# EAGLE design Pyr0-Piezo-FFC-Direct-Creality-X-Board.2.1.2 (EAGLE 9.5.1)
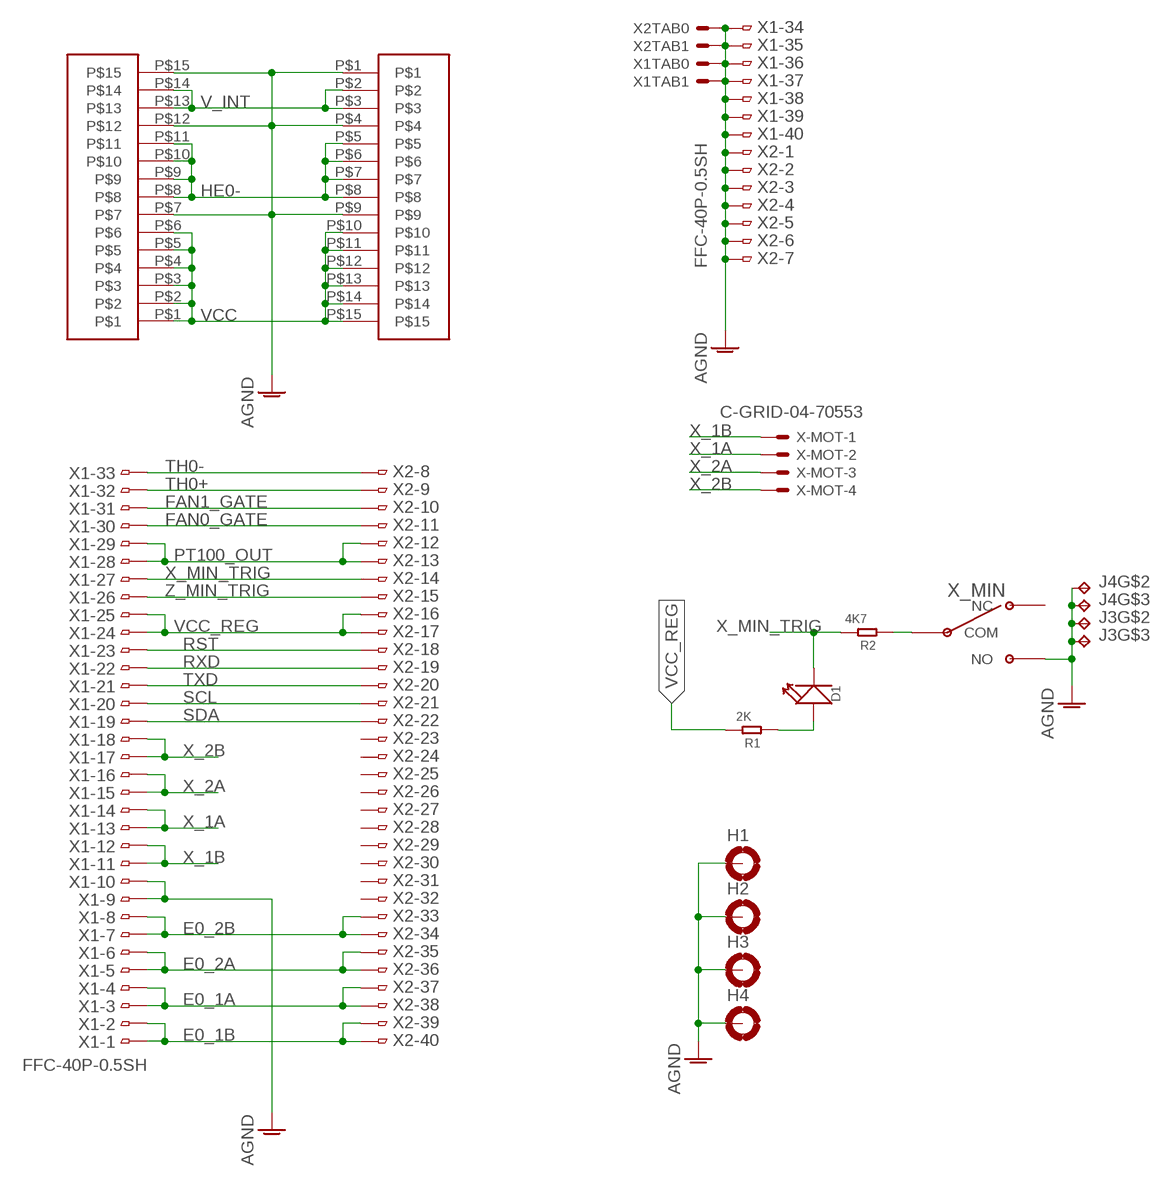
[diagram p0: schematic, sheet 1]

## Parts
D1  SEEED-LED_SMD-LED-CLEAR-BLUE(0603)LED_0603  [SEEED-LED_LED-0603]
H1  HOLES_MOUNT-PAD-ROUND3.2  [HOLES_3,2-PAD]
H2  HOLES_MOUNT-PAD-ROUND3.2  [HOLES_3,2-PAD]
H3  HOLES_MOUNT-PAD-ROUND3.2  [HOLES_3,2-PAD]
H4  HOLES_MOUNT-PAD-ROUND3.2  [HOLES_3,2-PAD]
J3  FFC-15P-1MM  [FFC-15P-1MM]
J4  FFC-15P-1MM  [FFC-15P-1MM]
R1  2K  SMD-RES-2K-5%-1/8W(0805)  [R0805]
R2  4K7  SMD-RES-2K-5%-1/8W(0805)  [R0805]
X1  FFC-40P-0.5SH  [FH12-40S-0.5SH]
X2  FFC-40P-0.5SH  [FH12-40S-0.5SH]
X-MOT  C-GRID-04-70553  [70553-04]
X_MIN  LIMIT_SWITCH  [LIMIT_SWITCH_BRIDGE]

## Nets
AGND [VCC]: H1.B3,2(MOUNT) H2.B3,2(MOUNT) H3.B3,2(MOUNT) H4.B3,2(MOUNT) J3.P$7 J3.P$12 J3.P$15 J3.P$16(TP) J3.P$17(TP) J4.P$1 J4.P$4 J4.P$9 J4.P$16(TP) J4.P$17(TP) X1.9 X1.10 X1.34 X1.35 X1.36 X1.37 X1.38 X1.39 X1.40 X1.TAB0 X1.TAB1 X2.1 X2.2 X2.3 X2.4 X2.5 X2.6 X2.7 X2.TAB0 X2.TAB1 X_MIN.NO
E0_1A [Motor]: X1.3 X1.4 X2.37 X2.38
E0_1B [Motor]: X1.1 X1.2 X2.39 X2.40
E0_2A [Motor]: X1.5 X1.6 X2.35 X2.36
E0_2B [Motor]: X1.7 X1.8 X2.33 X2.34
FAN0_GATE [Fan]: X1.30 X2.11
FAN1_GATE [Fan]: X1.31 X2.10
HE0- [VCC]: J3.P$8 J3.P$9 J3.P$10 J3.P$11 J4.P$5 J4.P$6 J4.P$7 J4.P$8
PT100_OUT [Fan]: X1.28 X1.29 X2.12 X2.13
RST: X1.23 X2.18
RXD: X1.22 X2.19
SCL: X1.20 X2.21
SDA: X1.19 X2.22
TH0+: X1.32 X2.9
TH0-: X1.33 X2.8
TXD: X1.21 X2.20
V_INT [Fan]: J3.P$13 J3.P$14 J4.P$2 J4.P$3
VCC [VCC]: J3.P$1 J3.P$2 J3.P$3 J3.P$4 J3.P$5 J3.P$6 J4.P$10 J4.P$11 J4.P$12 J4.P$13 J4.P$14 J4.P$15
VCC_REG [Fan]: R1.2 X1.24 X1.25 X2.16 X2.17
X_1A [Motor]: X1.13 X1.14 X-MOT.2
X_1B [Motor]: X1.11 X1.12 X-MOT.1
X_2A [Motor]: X1.15 X1.16 X-MOT.3
X_2B [Motor]: X1.17 X1.18 X-MOT.4
X_MIN_LED: D1.+ R1.1
X_MIN_TRIG: D1.- R2.2 X1.27 X2.14
X_PULLDOWN: R2.1 X_MIN.COM
Z_MIN_TRIG: X1.26 X2.15
Unconnected: X2.23 X2.24 X2.25 X2.26 X2.27 X2.28 X2.29 X2.30 X2.31 X2.32 X_MIN.NC

## Library data of the parts
D1 = PiezoFFC:SEEED-LED_SMD-LED-CLEAR-BLUE(0603): 304090045
H1-H4 = PiezoFFC:HOLES_MOUNT-PAD-ROUND: MOUNTING PAD, round
J3 J4 = PiezoFFC:FFC-15P-1MM
R1 = PiezoFFC:SMD-RES-2K-5%-1/8W(0805): 301010318; MPN: RC0805JR-072KL
R2 = PiezoFFC:SMD-RES-2K-5%-1/8W(0805): 301010318; MPN: RC0805JR-072KL; VALUE: 2K
X1 X2 = PiezoFFC:FFC-40P-0.5S: 0.5mm Pitch Connectors For FPC/FFC Source: Data sheet <http://www.hirose.co.jp/cataloge_hp/e58605370.pdf>; MPN: FH12-40S-0.5SH(55); OC_FARNELL: 1324556; OC_NEWARK: 34M6178
X-MOT = PiezoFFC:C-GRID-04: CONNECTOR wire to board 2.54 mm (0.100") pitch header; MF: MOLEX; OC_FARNELL: unknown; OC_NEWARK: unknown
X_MIN = PiezoFFC:LIMIT_SWITCH

## Net classes
1 Motor: width 0.61 mm, drill 0.45 mm, clearance 0.254 mm to class 0, clearance 0.254 mm
2 Fan: width 0.305 mm, drill 0.35 mm, clearance 0.152 mm to class 0, clearance 0.254 mm to class 1, clearance 0.152 mm
3 VCC: width 1.27 mm, drill 0.5 mm, clearance 0.254 mm to class 0, clearance 0.254 mm to class 1, clearance 0.254 mm to class 2, clearance 0.254 mm

## Board
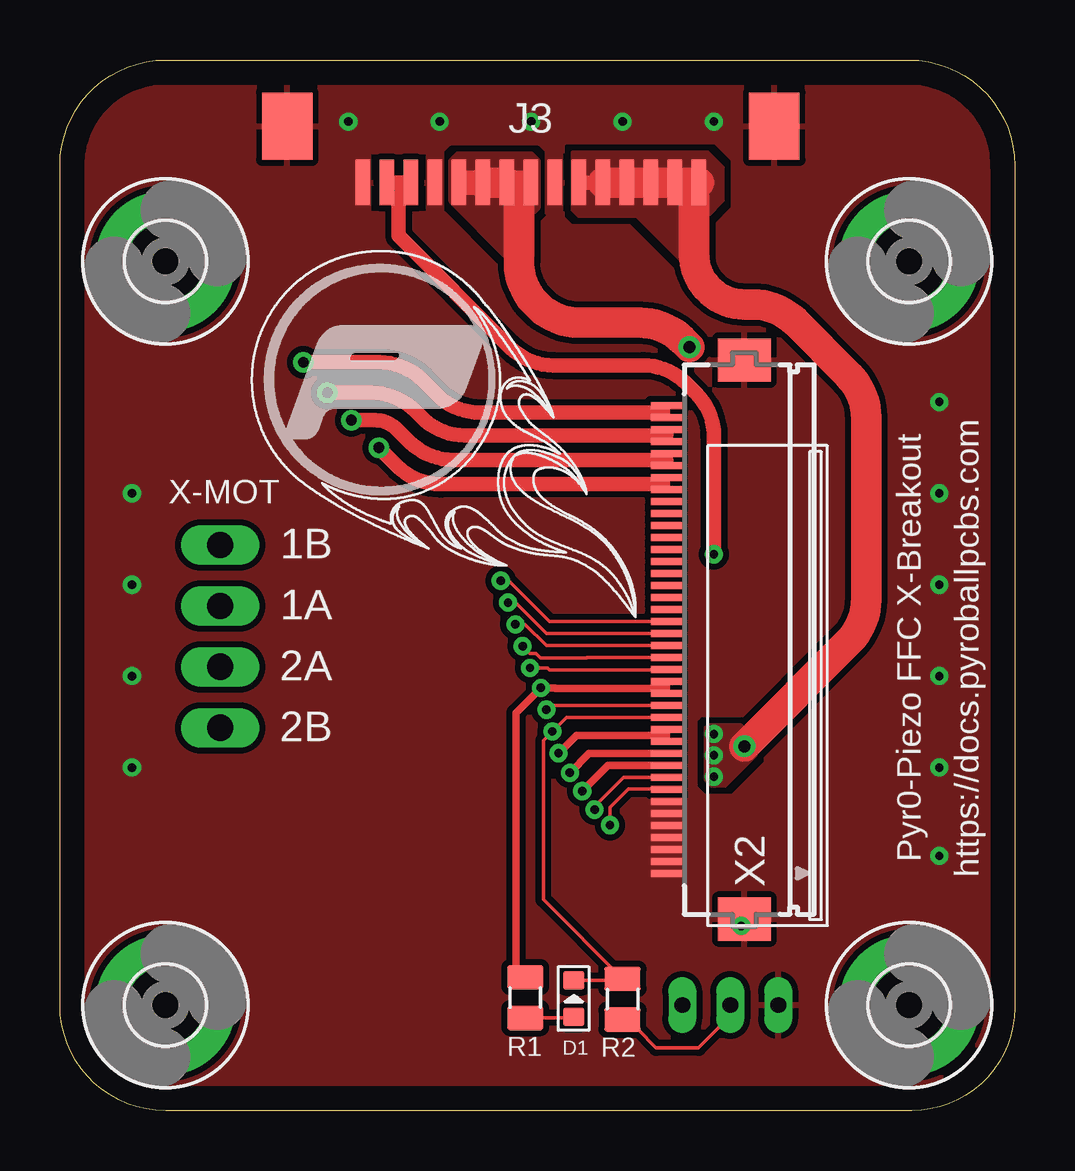
[diagram p1: board, top side]
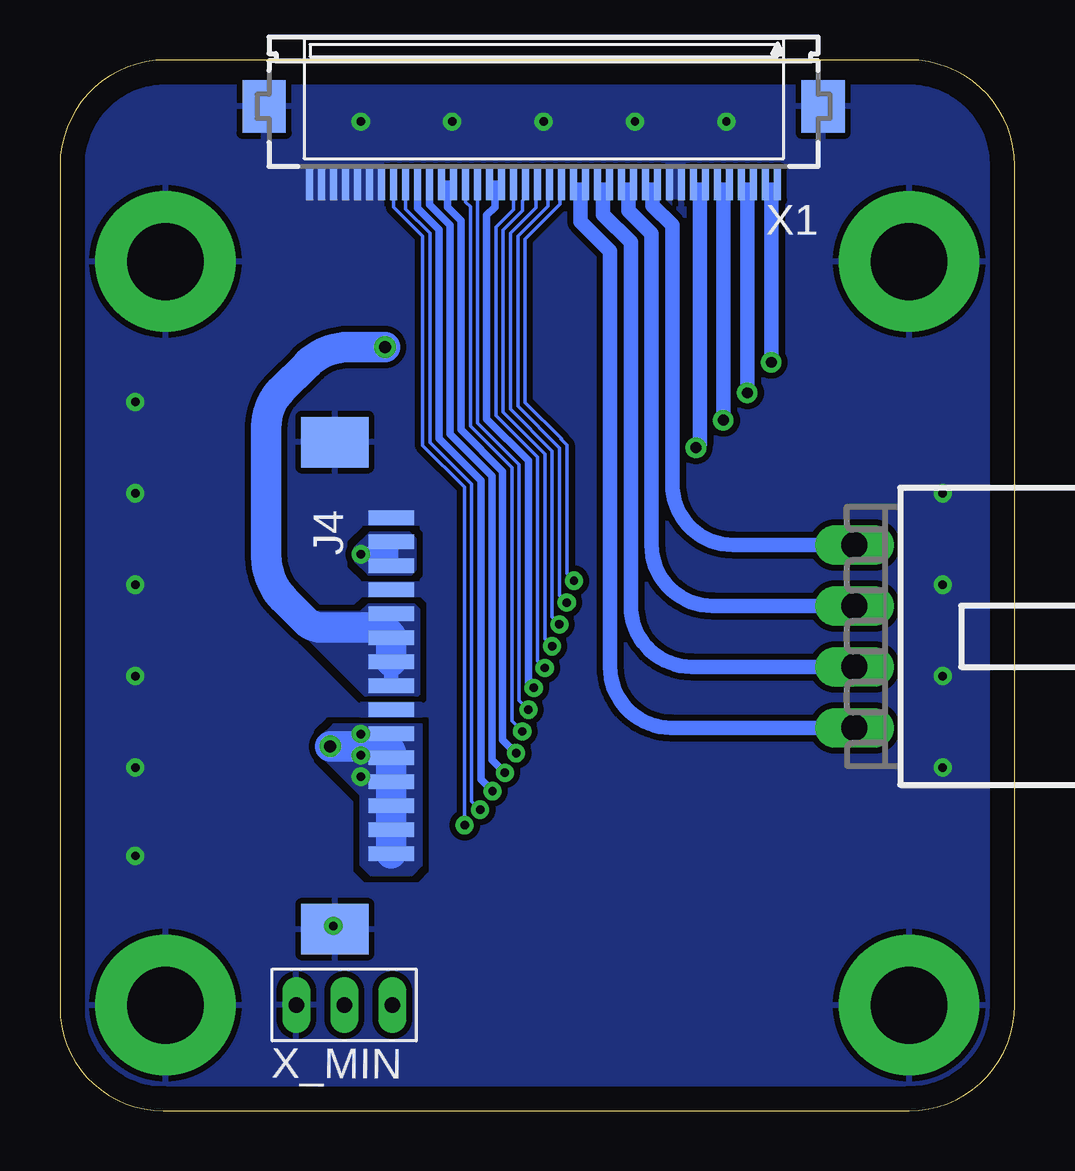
[diagram p2: board, bottom side, seen from below]

Size 39.8 x 43.8 mm. Coordinates in mm from the lower left corner, seen from the top.
Outline: 4.4,0 arc-90 0,4.4 0,39.4 arc-90 4.4,43.8 35.4,43.8 arc-90 39.8,39.4 39.8,4.3 arc-90 35.5,0 4.4,0
Copper layers (1*16): Top 0.035mm / dielectric 1.5mm / Bottom 0.035mm
Design rules "default *": minimum track width 6mil, minimum drill 0.35mm, track to track 6mil, track to pad 6mil, pad to pad 6mil, via to via 6mil, smd to smd 6mil, copper to edge 40mil, drill to drill 6mil, minimum pad ring 10mil, minimum via ring 8mil, stop-mask expansion 4mil, vias tented up to drill 0.5mm, thermal gap 10mil

### Footprints (pad centres in the part's own frame; a part is rotated, then mirrored left to right if it is on the bottom)
SEEED-LED_LED-0603 = smd 0.762 x 0.889: + -0.762,0; - 0.762,0
HOLES_3,2-PAD = drill 3.2 pad 5.842: B3,2 0,0
FFC-15P-1MM = smd 0.6 x 1.9: P$1 0,0; P$2 1,0; P$3 2,0; P$4 3,0; P$5 4,0; P$6 5,0; P$7 6,0; P$8 7,0; P$9 8,0; P$10 9,0; P$11 10,0; P$12 11,0; P$13 12,0; P$14 13,0; P$15 14,0 | smd 2.1 x 2.8: P$16 -3.15,-2.35; P$17 17.15,-2.35
R0805 = smd 1 x 1.5: 1 -0.85,0; 2 0.85,0
FH12-40S-0.5SH = smd 0.3 x 1.3: 1 -9.75,3.25; 2 -9.25,3.25; 3 -8.75,3.25; 4 -8.25,3.25; 5 -7.75,3.25; 6 -7.25,3.25; 7 -6.75,3.25; 8 -6.25,3.25; 9 -5.75,3.25; 10 -5.25,3.25; 11 -4.75,3.25; 12 -4.25,3.25; 13 -3.75,3.25; 14 -3.25,3.25; 15 -2.75,3.25; 16 -2.25,3.25; 17 -1.75,3.25; 18 -1.25,3.25; 19 -0.75,3.25; 20 -0.25,3.25; 21 0.25,3.25; 22 0.75,3.25; 23 1.25,3.25; 24 1.75,3.25; 25 2.25,3.25; 26 2.75,3.25; 27 3.25,3.25; 28 3.75,3.25; 29 4.25,3.25; 30 4.75,3.25; 31 5.25,3.25; 32 5.75,3.25; 33 6.25,3.25; 34 6.75,3.25; 35 7.25,3.25; 36 7.75,3.25; 37 8.25,3.25; 38 8.75,3.25; 39 9.25,3.25; 40 9.75,3.25 | smd 1.8 x 2.2: TAB0 -11.65,0; TAB1 11.65,0
70553-04 = drill 1.092 long: 1 -3.81,-7.62; 2 -1.27,-7.62; 3 1.27,-7.62; 4 3.81,-7.62
LIMIT_SWITCH_BRIDGE = drill 0.65 long: COM 0,0; NC -2,0; NO 2,0

### Placement (x,y rotation side)
D1  21.41,4.68 90 top
H1  4.4,4.4 0 top
H2  4.4,35.4 0 top
H3  35.4,4.4 0 top
H4  35.4,35.4 0 top
J3  26.62,38.69 180 top
J4  25.99,24.72 270 bottom
R1  19.39,4.72 90 top
R2  23.45,4.65 90 top
U$1  [LOGO-PYR0BALL]  2.75,20.27 0 top
X1  19.64,41.87 180 bottom
X2  28.53,19.64 90 top
X-MOT  -0.94,19.77 270 bottom
X_MIN  27.95,4.41 180 bottom

### Tracks (layer width: path | path; a pad name or v marks a point on that pad's centre or on a via)
AGND  (via drill 0.35)
  other vias: 3,25.74 3,14.31 3,18.12 3,21.93 36.66,18.12 27.26,41.23 23.45,41.23 19.64,41.23 15.83,41.23 12.02,41.23 36.66,21.93 28.4,7.7 36.66,25.74 36.66,10.62 36.66,29.55 36.66,14.31
  pour Top (rank 6): 4.4,0 arc-90 0,4.4 0,39.4 arc-90 4.4,43.8 35.4,43.8 arc-90 39.8,39.4 39.8,4.3 arc-90 35.5,0
  pour Bottom (rank 6): 4.4,0 arc-90 0,4.4 0,39.4 arc-90 4.4,43.8 35.4,43.8 arc-90 39.8,39.4 39.8,4.3 arc-90 35.5,0
  pour Bottom (no thermals): 26.62,39.58 26.37,39.32 26.37,39.2 26.37,37.93 26.62,37.67 29.29,37.67 29.55,37.67 29.8,37.93 29.8,39.32 29.55,39.58
  pour Bottom (no thermals): 24.72,16.97 27.26,16.97 27.26,16.46 24.72,16.46
  pour Bottom (no thermals): 24.66,21.99 27.2,21.99 27.2,21.48 24.66,21.48
  pour Bottom (no thermals): 24.72,25.35 27.26,25.35 27.26,24.47 24.72,24.47
  pour Top (no thermals): 24.4,13.1 26.05,13.1 26.37,12.78 26.37,9.73 25.99,9.35 24.59,9.35 24.21,9.73 24.21,12.91
  pour Top (no thermals): 12.91,39.83 12.91,37.42 12.27,37.42 12.02,37.67 12.02,39.58 12.27,39.83
  pour Top (no thermals): 15.32,39.96 15.32,37.42 15.96,37.42 15.96,39.96
  pour Top (no thermals): 20.27,39.96 20.27,37.42 20.91,37.42 20.91,39.96
  pour Bottom (no thermals): 13.8,39.58 13.8,38.05 14.5,38.05 14.5,39.58
E0_1A  (via drill 0.45)
  Top 0.305: X2.38 25.28,28.18 X2.37
  Top 0.61: v11.15,29.93 13,29.93 arc-45 14.8,29.18 15.09,28.89 arc45 16.88,28.15 25.04,28.15 25.07,28.18 25.28,28.18
  Bottom 0.152: X1.3 X1.4 11.14,38.36
  Bottom 0.61: v11.15,29.93 11.14,29.94 11.14,38.36
E0_1B  (via drill 0.45)
  Top 0.305: X2.40 25.28,29.1 | 24.99,29.1 X2.40 | X2.39 X2.40
  Top 0.61: v10.15,31.2 13.32,31.2 arc-45 15.11,30.45 15.72,29.84 arc45 17.52,29.1 24.99,29.1
  Bottom 0.152: X1.1 X1.2 10.14,38.36
  Bottom 0.61: v10.15,31.2 v10.14,31.21 10.14,38.36
E0_2A  (via drill 0.45)
  Top 0.305: X2.35 25.28,27.1 X2.36
  Top 0.61: v12.14,28.78 13.13,28.78 arc-45 14.05,28.4 14.58,27.88 arc45 16.37,27.13 25.04,27.13 25.07,27.1 25.28,27.1
  Bottom 0.152: X1.5 X1.6 12.13,38.36
  Bottom 0.61: v12.14,28.78 12.13,28.8 12.13,38.36
E0_2B  (via drill 0.45)
  Top 0.305: X2.34 X2.33 25.05,26.12
  Top 0.61: v13.29,27.64 14.07,26.86 arc45 15.87,26.12 25.05,26.12
  Bottom 0.152: X1.7 X1.8 13.13,38.36
  Bottom 0.61: v13.29,27.64 13.13,27.8 13.13,38.36
FAN0_GATE  (via drill 0.35)
  Top 0.305: v21.26,14.09 22.06,14.89 X2.11
  Bottom 0.305: X1.30 24.39,37.78 23.53,36.92 23.53,28.59 23.54,28.58 23.54,28.2 21.8,26.46 21.8,14.63 v21.26,14.09
FAN1_GATE  (via drill 0.35)
  Top 0.305: X2.10 22.84,14.38 v21.77,13.32
  Bottom 0.305: X1.31 24.89,37.63 23.99,36.73 23.99,28.77 23.99,28.01 22.26,26.27 22.26,13.8 v21.77,13.32
HE0-  (via drill 0.5)
  Top 1.016: J3.P$9 19.44,38.69 | 16.81,38.69 J3.P$10
  Top 1.27: J3.P$10 J3.P$9 19.13,38.18 19.13,35.39 arc90 21.67,32.85 24.18,32.85 arc-45 25.97,32.1 v26.24,31.83
  Bottom 0.61: J4.P$8 J4.P$7 | J4.P$5 26.02,20.69 26.02,19.8
  Bottom 1.27: v26.24,31.83 27.73,31.83 arc-45 29.53,31.09 30.56,30.05 arc-45 31.2,28.52 31.2,23.1 arc-45 30.45,21.31 29.55,20.4 arc-45 28.93,20.15 26.37,20.15 26.02,19.8 | 26.02,19.8 arc45 J4.P$6 | J4.P$7 25.99,19.77 26.02,19.8
  pour Bottom (no thermals): 26.94,21.1 25.04,21.1 24.85,20.91 24.85,17.35 25.1,17.1 26.88,17.1 29.55,19.77 29.55,20.4 29.16,20.78 27.26,20.78
  pour Top (no thermals): 16.59,39.83 16.34,39.58 16.34,37.93 18.62,35.64 19.64,35.64 19.64,37.42 19.89,37.67 19.89,39.58 19.64,39.83
PT100_OUT  (via drill 0.35)
  Top 0.305: X2.13 X2.12 25.03,15.64 21.52,15.64 v20.78,14.9
  Bottom 0.305: X1.28 X1.29 23.64,38.37 23.64,37.67 23.08,37.11 23.08,28.4 23.08,28.39 21.34,26.65 21.34,15.46 v20.78,14.9
RST  (via drill 0.35)
  Top 0.152: X2.18 25.26,18.37 20.4,18.37 20.32,18.46 v19.59,18.46
  Bottom 0.152: X1.23 20.89,37.57 21.63,36.83 21.63,28.99 19.89,27.25 19.89,18.76 v19.59,18.46
RXD  (via drill 0.35)
  Top 0.152: X2.19 21.96,18.89 21.95,18.88 20.03,18.88 19.84,19.06 19.59,19.06 v19.29,19.37
  Bottom 0.152: X1.22 20.38,38.05 20.51,37.93 20.51,37.52 21.32,36.7 21.32,29.11 19.59,27.38 19.59,19.67 v19.29,19.37
SCL  (via drill 0.35)
  Top 0.152: v18.68,21.18 18.99,21.18 20.28,19.89 X2.21
  Bottom 0.152: X1.20 19.45,38.56 19.45,37.72 20.71,36.45 20.71,29.37 18.98,27.63 18.98,21.48 v18.68,21.18
SDA  (via drill 0.35)
  Top 0.152: v18.37,22.09 18.71,22.09 20.41,20.39 X2.22
  Bottom 0.152: X1.19 18.95,38.56 18.95,37.78 20.41,36.32 20.41,29.53 18.89,28.01 18.91,27.99 18.68,27.76 18.68,22.39 v18.37,22.09
TH0+  (via drill 0.35)
  Top 0.152: X2.9 23.48,13.89 22.29,12.69 v22.29,12.55
  Bottom 0.152: X1.32 25.39,37.59 24.37,36.57 24.37,28.93 24.38,28.93 24.38,27.85 22.64,26.12 22.64,12.9 v22.29,12.55
TH0-  (via drill 0.35)
  Top 0.152: v22.93,11.91 22.93,12.64 23.7,13.42 25.25,13.42 X2.8
  Bottom 0.152: X1.33 25.89,37.66 24.68,36.45 24.68,29.06 24.68,29.05 24.68,27.73 22.94,25.99 22.94,11.92 v22.93,11.91
TXD  (via drill 0.35)
  Top 0.152: X2.20 21.9,19.39 21.89,19.39 20.27,19.39 19.39,20.27 v18.98,20.27
  Bottom 0.152: X1.21 19.95,38.56 19.95,37.65 21.02,36.58 21.02,29.24 19.28,27.51 19.28,20.58 v18.98,20.27
V_INT  (via drill 0.35)
  Top 0.305: J3.P$13 14.12,38.18 14.12,38.12
  Top 0.61: J3.P$14 J3.P$13 | 14.12,38.12 14.12,36.47 18.77,31.81 arc45 20.56,31.07 24.3,31.07 arc-45 26.1,30.33 26.52,29.91 arc-45 27.26,28.11 v27.26,23.2
  Bottom 0.61: v27.26,23.2 26.51,23.2 J4.P$2 J4.P$3
  pour Bottom (no thermals): 26.88,24.09 27.51,23.45 27.51,22.94 26.94,22.37 25.16,22.37 24.97,22.56 24.97,23.83 25.23,24.09
VCC  (via drill 0.35, 0.5)
  Top 0.61: J3.P$6 J3.P$5
  Top 1.016: J3.P$1 26.44,38.5
  Top 1.27: J3.P$5 J3.P$4 J3.P$3 | 26.44,38.5 26.44,35.7 arc90 28.53,33.61 28.88,33.61 arc-45 30.67,32.87 32.87,30.67 arc-45 33.61,28.88 33.61,21.33 arc-45 32.87,19.53 v28.53,15.2 | J3.P$3 J3.P$1 J3.P$2 | 24.72,38.69 J3.P$3 | J3.P$3 24.85,38.69 | J3.P$3 25.61,38.69
  Bottom 0.61: 26.37,15.2 arc-90 25.99,15.58 J4.P$10
  Bottom 1.27: v28.53,15.2 26.37,15.2 arc90 25.99,14.81 J4.P$11 J4.P$12 J4.P$13 J4.P$14 J4.P$15
  other vias: 27.26,13.93 27.26,14.81 27.26,15.7
  pour Bottom (no thermals): 24.72,16.08 28.4,16.08 28.91,15.58 28.91,14.81 27.26,13.16 27.26,10.24 26.88,9.86 25.1,9.86 24.72,10.24
  pour Top (no thermals): 29.04,15.45 28.4,16.08 27.01,16.08 26.88,15.96 26.88,13.8 27.13,13.54 27.77,13.54 29.04,14.81
  pour Top (no thermals): 21.35,39.96 21.35,37.55 21.61,37.29 24.02,37.29 25.86,35.45 27.01,35.45 27.01,37.29 27.64,37.93 27.64,39.32 27.01,39.96
VCC_REG  (via drill 0.35)
  Top 0.305: X2.16 X2.17 25,17.61 20.66,17.61 20.64,17.63 v20.05,17.63 19.01,16.58 19.01,5.96 R1.2
  Bottom 0.305: X1.24 X1.25 21.67,38.4 21.67,37.67 22.01,37.34 22.01,28.83 20.27,27.09 20.27,17.85 v20.05,17.63
X_1A
  Bottom 0.152: X1.13 X1.14 16.15,38.38
  Bottom 0.61: 16.15,38.38 16.1,38.32 16.1,37.51 15.14,36.55 15.14,23.59 arc-90 12.6,21.05 X-MOT.2
X_1B
  Bottom 0.152: X1.11 X1.12 15.15,38.38
  Bottom 0.61: 15.15,38.38 15.1,38.32 15.1,37.73 14.28,36.91 14.28,26.12 arc-90 11.74,23.59 X-MOT.1
X_2A
  Bottom 0.152: X1.15 X1.16 17.16,38.38 17.15,38.38
  Bottom 0.61: 17.16,38.38 17.16,37.35 16,36.2 16,21.05 arc-90 13.46,18.51 X-MOT.3
X_2B
  Bottom 0.152: X1.17 X1.18 18.15,38.38
  Bottom 0.61: 7.46,15.96 X-MOT.4 14.33,15.96 arc90 16.87,18.51 16.87,35.84 18.1,37.07 18.1,38.32 18.15,38.38
X_MIN_LED
  Top 0.152: D1.+ 21.37,3.87 R1.1
X_MIN_TRIG  (via drill 0.35)
  Top 0.152: D1.- 23.39,5.44 R2.2 20.15,8.8 20.15,15.43 v20.53,15.81 21.11,16.39 X2.14
  Bottom 0.152: X1.27 22.89,37.88 22.7,37.68 22.7,28.55 20.96,26.81 20.96,16.24 v20.53,15.81
X_PULLDOWN
  Top 0.152: R2.1 23.8,3.8 24.09,3.51 24.09,3.38 24.85,2.62 26.62,2.62 27.95,3.95 X_MIN.COM
Z_MIN_TRIG  (via drill 0.35)
  Top 0.152: X2.15 20.45,16.89 v20.27,16.72
  Bottom 0.152: X1.26 22.39,28.67 20.66,26.94 20.66,17.1 v20.27,16.72

### Text on the board
tPlace: 1B | 1A | 2A | 2B | Pyr0-Piezo FFC X-Breakout | https://docs.pyroballpcbs.com